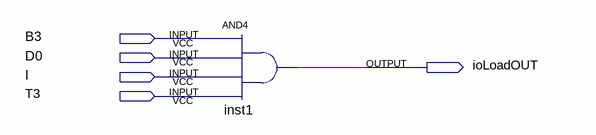
[diagram p0: schematic sheet]
// Quartus schematic ioLoad.bdf as structural Verilog: 1 symbols, 5 pins
module ioLoad (
  input  B3,
  input  D0,
  input  I,
  input  T3,
  output ioLoadOUT
);

  and inst1 (ioLoadOUT, B3, D0, I, T3);
endmodule
